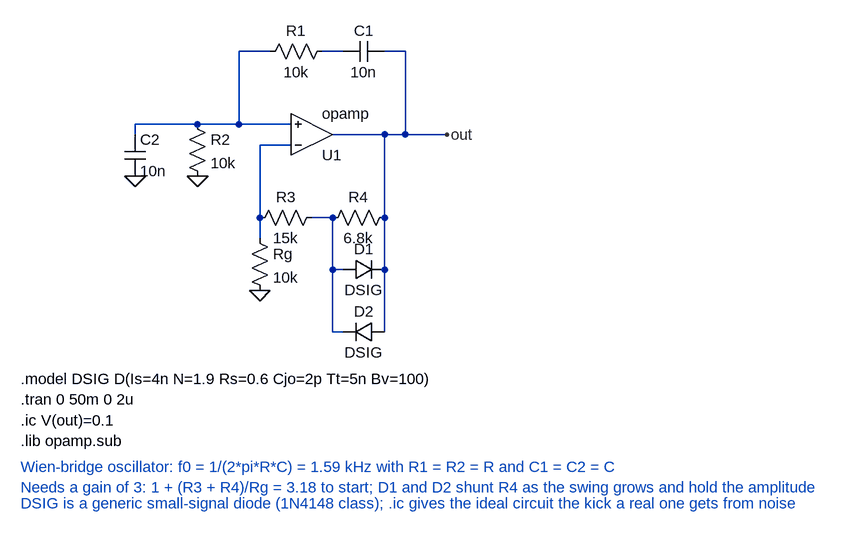
[diagram p0: schematic wien_bridge_oscillator.asc]
wien_bridge_oscillator.asc, the LTspice schematic file:
Version 4
SHEET 1 880 680
WIRE 624 64 624 192
WIRE 624 64 592 64
WIRE 528 64 496 64
WIRE 416 64 368 64
WIRE 368 176 368 64
WIRE 304 176 208 176
WIRE 368 176 304 176
WIRE 448 176 368 176
WIRE 208 192 208 176
WIRE 400 208 448 208
WIRE 400 352 400 208
WIRE 688 192 512 192
WIRE 592 320 592 192
WIRE 512 320 480 320
WIRE 512 496 512 320
WIRE 528 400 512 400
WIRE 528 496 512 496
WIRE 592 496 592 320
FLAG 208 256 0
FLAG 304 256 0
FLAG 400 432 0
FLAG 688 192 out
SYMBOL OpAmps\opamp 480 256 M180
SYMATTR InstName U1
SYMBOL cap 592 48 R90
WINDOW 0 0 32 VBottom 2
WINDOW 3 32 32 VTop 2
SYMATTR InstName C1
SYMATTR Value 10n
SYMBOL res 512 48 R90
WINDOW 0 0 56 VBottom 2
WINDOW 3 32 56 VTop 2
SYMATTR InstName R1
SYMATTR Value 10k
SYMBOL res 288 160 R0
SYMATTR InstName R2
SYMATTR Value 10k
SYMBOL cap 192 192 R0
SYMATTR InstName C2
SYMATTR Value 10n
SYMBOL res 496 304 R90
WINDOW 0 0 56 VBottom 2
WINDOW 3 32 56 VTop 2
SYMATTR InstName R3
SYMATTR Value 15k
SYMBOL res 608 304 R90
WINDOW 0 0 56 VBottom 2
WINDOW 3 32 56 VTop 2
SYMATTR InstName R4
SYMATTR Value 6.8k
SYMBOL res 384 336 R0
SYMATTR InstName Rg
SYMATTR Value 10k
SYMBOL diode 528 416 R270
WINDOW 0 32 32 VTop 2
WINDOW 3 0 32 VBottom 2
SYMATTR InstName D1
SYMATTR Value DSIG
SYMBOL diode 592 480 R90
WINDOW 0 0 32 VBottom 2
WINDOW 3 32 32 VTop 2
SYMATTR InstName D2
SYMATTR Value DSIG
TEXT 32 568 Left 2 !.model DSIG D(Is=4n N=1.9 Rs=0.6 Cjo=2p Tt=5n Bv=100)
TEXT 32 600 Left 2 !.tran 0 50m 0 2u
TEXT 32 632 Left 2 !.ic V(out)=0.1
TEXT 32 664 Left 2 !.lib opamp.sub
TEXT 32 704 Left 2 ;Wien-bridge oscillator: f0 = 1/(2*pi*R*C) = 1.59 kHz with R1 = R2 = R and C1 = C2 = C\nNeeds a gain of 3: 1 + (R3 + R4)/Rg = 3.18 to start; D1 and D2 shunt R4 as the swing grows and hold the amplitude
TEXT 32 760 Left 2 ;DSIG is a generic small-signal diode (1N4148 class); .ic gives the ideal circuit the kick a real one gets from noise

The netlist it stands for:
* wien_bridge_oscillator.asc
XU1 N003 N002 out opamp Aol=100K GBW=10Meg  ; pins invin noninvin out
C1 out N001 10n
R1 N001 N002 10k
R2 N002 0 10k
C2 N002 0 10n
R3 N004 N003 15k
R4 out N004 6.8k
Rg N003 0 10k
D1 N004 out DSIG
D2 out N004 DSIG
.model D D
.lib standard.dio
.model DSIG D(Is=4n N=1.9 Rs=0.6 Cjo=2p Tt=5n Bv=100)
.tran 0 50m 0 2u
.ic V(out)=0.1
.lib opamp.sub
* Wien-bridge oscillator: f0 = 1/(2*pi*R*C) = 1.59 kHz with R1 = R2 = R and C1 = C2 = C
* Needs a gain of 3: 1 + (R3 + R4)/Rg = 3.18 to start; D1 and D2 shunt R4 as the swing grows and hold the amplitude
* DSIG is a generic small-signal diode (1N4148 class); .ic gives the ideal circuit the kick a real one gets from noise
.backanno
.end